# Altium project Zapper.PrjPcb (part 1 of 3)
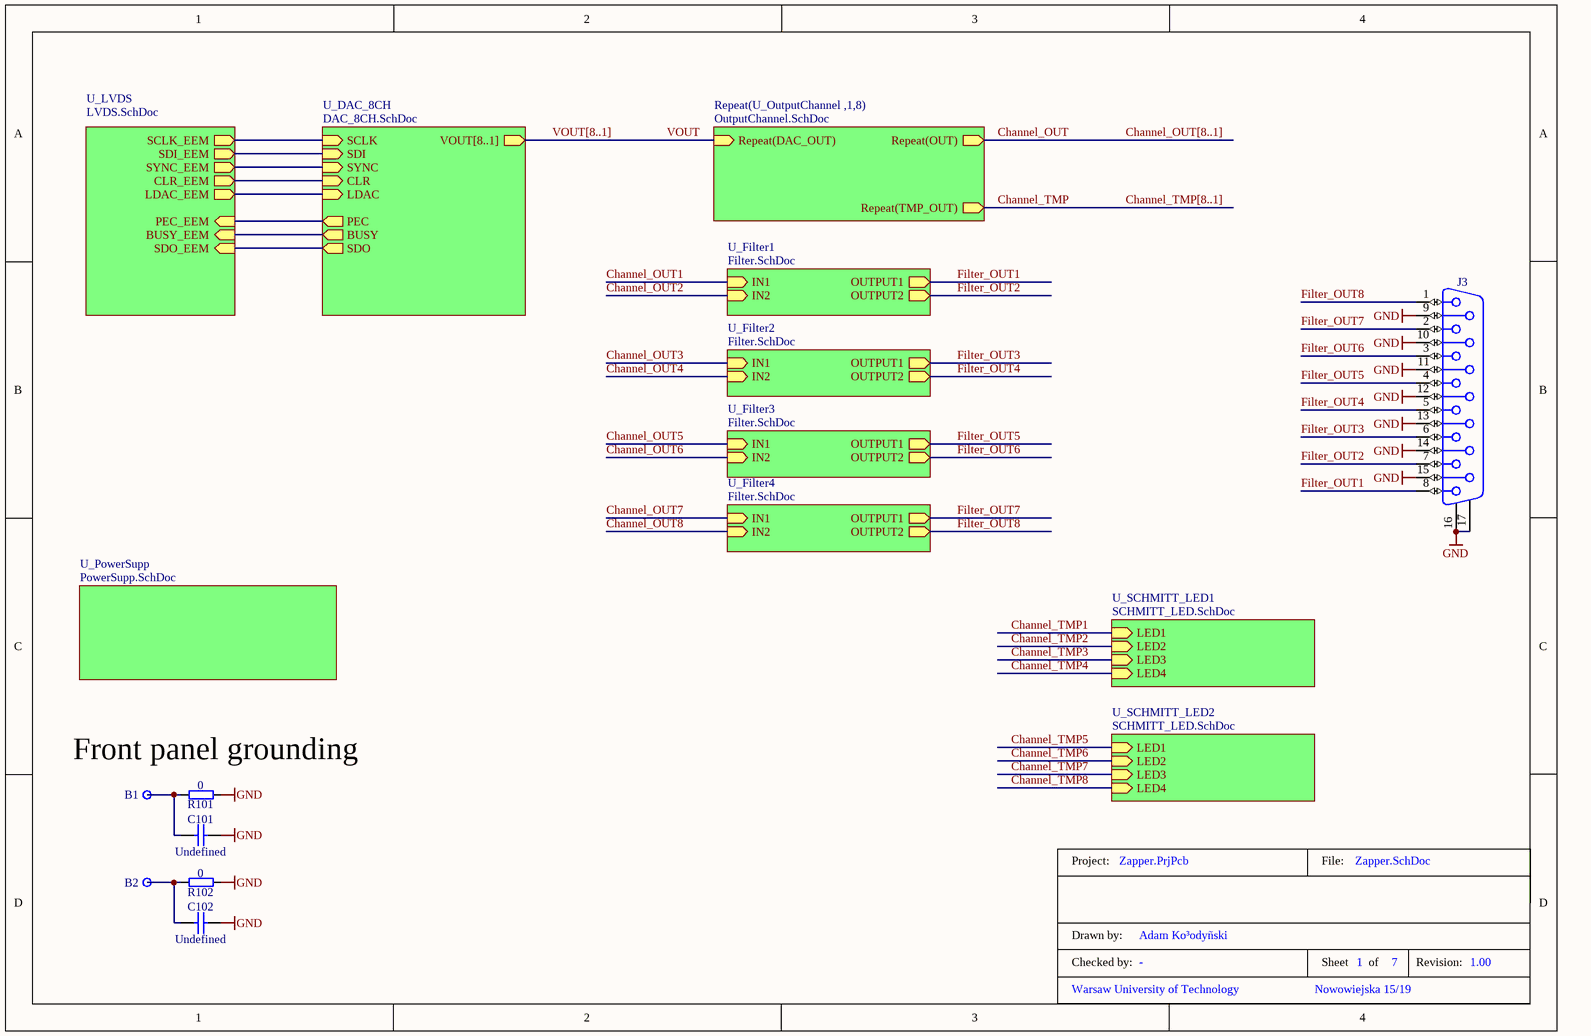
[diagram p0: Zapper.SchDoc]
AddressCompany: Nowowiejska 15/19; CheckedByName: -; Company: Warsaw University of Technology; DrawnByName: Adam Ko³odyñski; RevisionNumber: 1.00
7 sheets, 431 parts. Net scope: hierarchical (ports join the sheet entries above them; power ports are global).
Board file: Zapper.PcbDoc
Sheets:
  Zapper.SchDoc
    U_LVDS = LVDS.SchDoc
    U_DAC_8CH = DAC_8CH.SchDoc
    U_SCHMITT_LED1 = SCHMITT_LED.SchDoc
    U_SCHMITT_LED2 = SCHMITT_LED.SchDoc
    U_OutputChannel1 = OutputChannel.SchDoc
    U_OutputChannel2 = OutputChannel.SchDoc
    U_OutputChannel3 = OutputChannel.SchDoc
    U_OutputChannel4 = OutputChannel.SchDoc
    U_OutputChannel5 = OutputChannel.SchDoc
    U_OutputChannel6 = OutputChannel.SchDoc
    U_OutputChannel7 = OutputChannel.SchDoc
    U_OutputChannel8 = OutputChannel.SchDoc
    U_PowerSupp = PowerSupp.SchDoc
    U_Filter1 = Filter.SchDoc
    U_Filter2 = Filter.SchDoc
    U_Filter3 = Filter.SchDoc
    U_Filter4 = Filter.SchDoc

## Sheet Zapper.SchDoc
size A4; DocumentNumber: 1; SheetNumber: 1; SheetTotal: 7

### Parts
B1  Plated Hole  [MTG270_500]  (value not drawn)
B2  Plated Hole  [MTG270_500]  (value not drawn)
C101  Undefined  [CAPC2012X135N]
C102  Undefined  [CAPC2012X135N]
J3  D-Sub 15F  [HARTING_09 66 252 6612]  (value not drawn)
R101  0  [RESC1608X55N]
R102  0  [RESC1608X55N]
TitleBlock1  TitleBlock  (value not drawn)  (graphical)

### Sub-sheets
Repeat(U_OutputChannel ,1,8) = OutputChannel.SchDoc: Repeat(OUT) (out), Repeat(DAC_OUT) (in), Repeat(TMP_OUT) (out)
U_DAC_8CH = DAC_8CH.SchDoc: SCLK (in), SDI (in), SYNC (in), BUSY (out), CLR (in), LDAC (in), PEC (out), SDO (out), VOUT[8..1] (out)
U_Filter1 = Filter.SchDoc: IN1 (in), IN2 (in), OUTPUT1 (out), OUTPUT2 (out)
U_Filter2 = Filter.SchDoc: IN1 (in), IN2 (in), OUTPUT1 (out), OUTPUT2 (out)
U_Filter3 = Filter.SchDoc: IN1 (in), IN2 (in), OUTPUT1 (out), OUTPUT2 (out)
U_Filter4 = Filter.SchDoc: IN1 (in), IN2 (in), OUTPUT1 (out), OUTPUT2 (out)
U_LVDS = LVDS.SchDoc: SCLK_EEM (out), SDO_EEM (in), SDI_EEM (out), SYNC_EEM (out), CLR_EEM (out), BUSY_EEM (in), LDAC_EEM (out), PEC_EEM (in)
U_PowerSupp = PowerSupp.SchDoc: no entries
U_SCHMITT_LED1 = SCHMITT_LED.SchDoc: LED1 (in), LED2 (in), LED3 (in), LED4 (in)
U_SCHMITT_LED2 = SCHMITT_LED.SchDoc: LED1 (in), LED2 (in), LED3 (in), LED4 (in)

### Nets
GND: C101.2 C102.2 J3.9 J3.10 J3.11 J3.12 J3.13 J3.14 J3.15 J3.16 J3.17 R101.1 R102.1
BUSY: sheet U_LVDS/BUSY_EEM, sheet U_DAC_8CH/BUSY
Channel_OUT: sheet Repeat(U_OutputChannel ,1,8)/Repeat(OUT)
Channel_TMP: sheet Repeat(U_OutputChannel ,1,8)/Repeat(TMP_OUT)
CLR: sheet U_LVDS/CLR_EEM, sheet U_DAC_8CH/CLR
Filter_OUT1: J3.8 ; sheet U_Filter1/OUTPUT1
Filter_OUT2: J3.7 ; sheet U_Filter1/OUTPUT2
Filter_OUT3: J3.6 ; sheet U_Filter2/OUTPUT1
Filter_OUT4: J3.5 ; sheet U_Filter2/OUTPUT2
Filter_OUT5: J3.4 ; sheet U_Filter3/OUTPUT1
Filter_OUT6: J3.3 ; sheet U_Filter3/OUTPUT2
Filter_OUT7: J3.2 ; sheet U_Filter4/OUTPUT1
Filter_OUT8: J3.1 ; sheet U_Filter4/OUTPUT2
LDAC: sheet U_LVDS/LDAC_EEM, sheet U_DAC_8CH/LDAC
PEC: sheet U_LVDS/PEC_EEM, sheet U_DAC_8CH/PEC
SCLK: sheet U_LVDS/SCLK_EEM, sheet U_DAC_8CH/SCLK
SDI: sheet U_LVDS/SDI_EEM, sheet U_DAC_8CH/SDI
SDO: sheet U_LVDS/SDO_EEM, sheet U_DAC_8CH/SDO
SYNC: sheet U_LVDS/SYNC_EEM, sheet U_DAC_8CH/SYNC
VOUT: sheet Repeat(U_OutputChannel ,1,8)/Repeat(DAC_OUT)
NetB1_1: B1.1 C101.1 R101.2
NetB2_1: B2.1 C102.1 R102.2

### Buses and harness runs
bus Channel_OUT[8..1]
bus Channel_TMP[8..1]
bus VOUT[8..1] = sheet U_DAC_8CH/VOUT[8..1]

### Notes on the sheet
- Front panel grounding
- (in symbol TitleBlock) Project:; File:; Drawn by:; Checked by:; Sheet; of; Revision:

### Library data of the parts
B1 B2 = PLATED_HOLE2.7_PAD5.0: Single Terminal Socket; Part Description: Plated Through Hole: Hole Dia.=2.7mm Pad Dia.=5.0mm; Mounted: No; Part Number: PLATED_HOLE2.7_PAD5.0; Component Kind: Standard (No BOM); Component Type: Standard (No BOM); Pin Count: 1; Family: Plated Hole; Socket: No; SMD: No; Sense: No; Status: None; ComponentHeight: 0mm; HelpURL: Undefined; Author: CERN DEM JMW; CreateDate: 27.09.2011; LatestRevisionDate: 27.09.2011; PackageDescription: Plated Through Hole: Hole Dia.=2.7mm Pad Dia.=5.0mm
C101 C102 = CC0805_NO-VALUE: Non-polarised capacitor; Part Description: Reserved Footprint For 0805(2012) Chip Ceramic Capacitor; Mounted: No; Part Number: CC0805_NO-VALUE; Component Kind: Standard; Component Type: Standard; Pin Count: 2; Value: Undefined; Status: None; Manufacturer: Undefined; Manufacturer Part Number: CC0805_NO-VALUE; Case: 0805; Socket: No; SMD: Yes; Sense: No; Manufacturer1 ComponentHeight: 1.35mm; HelpURL: Undefined; Author: CERN DEM JLC; CreateDate: 10.12.2008; LatestRevisionDate: 11.09.2013
J3 = HARTING_09 66 252 6612: Connector D-sub 15 Female; Part Description: Right Angled D-Sub 15 Female Contacts With Grounding Board Locks And UNC 4-40 Flange Thread; PressFit: No; Part Number: HARTING_09 66 252 6612; Component Kind: Standard; Component Type: Standard; Pin Count: 17; Family: D-Sub 15F; Mounted: Yes; Socket: No; SMD: No; Sense: No; Status: None; Manufacturer: HARTING; Manufacturer Part Number: 09 66 252 6612; ComponentHeight: 13.6mm; HelpURL: \\cern.ch\dfs\Applications\Altium\Datasheets\HARTING_09 66 252 6612.pdf; Author: CERN DEM JLC; CreateDate: 17.07.2013; LatestRevisionDate: 17.07.2013
R101 R102 = R0603_0R_JUMPER: Resistor; Part Description: 1A (0.05R Max DC Resistance) Zero Ohm Jumper; Manufacturer: GENERIC; Manufacturer1 Part Number: NRC06Z0; PressFit: No; Part Number: R0603_0R_JUMPER; Component Kind: Standard; Component Type: Standard; Pin Count: 2; Value: 0; Status: Preferred; Manufacturer Part Number: R0603_0R_JUMPER; Case: 0603; Mounted: Yes; Sense: No; Socket: No; SMD: Yes; Manufacturer1 Example: NIC COMPONENT; Manufacturer1 ComponentHeight: 0.55mm; HelpURL: \\cern.ch\dfs\Applications\Altium\Datasheets\R0603_NIC_NRC.pdf; Author: CERN DEM JLC; CreateDate: 03.12.2007; LatestRevisionDate: 13.03.2008

## Sheet LVDS.SchDoc
size A4; DocumentNumber: 2; SheetNumber: 2; SheetTotal: 7
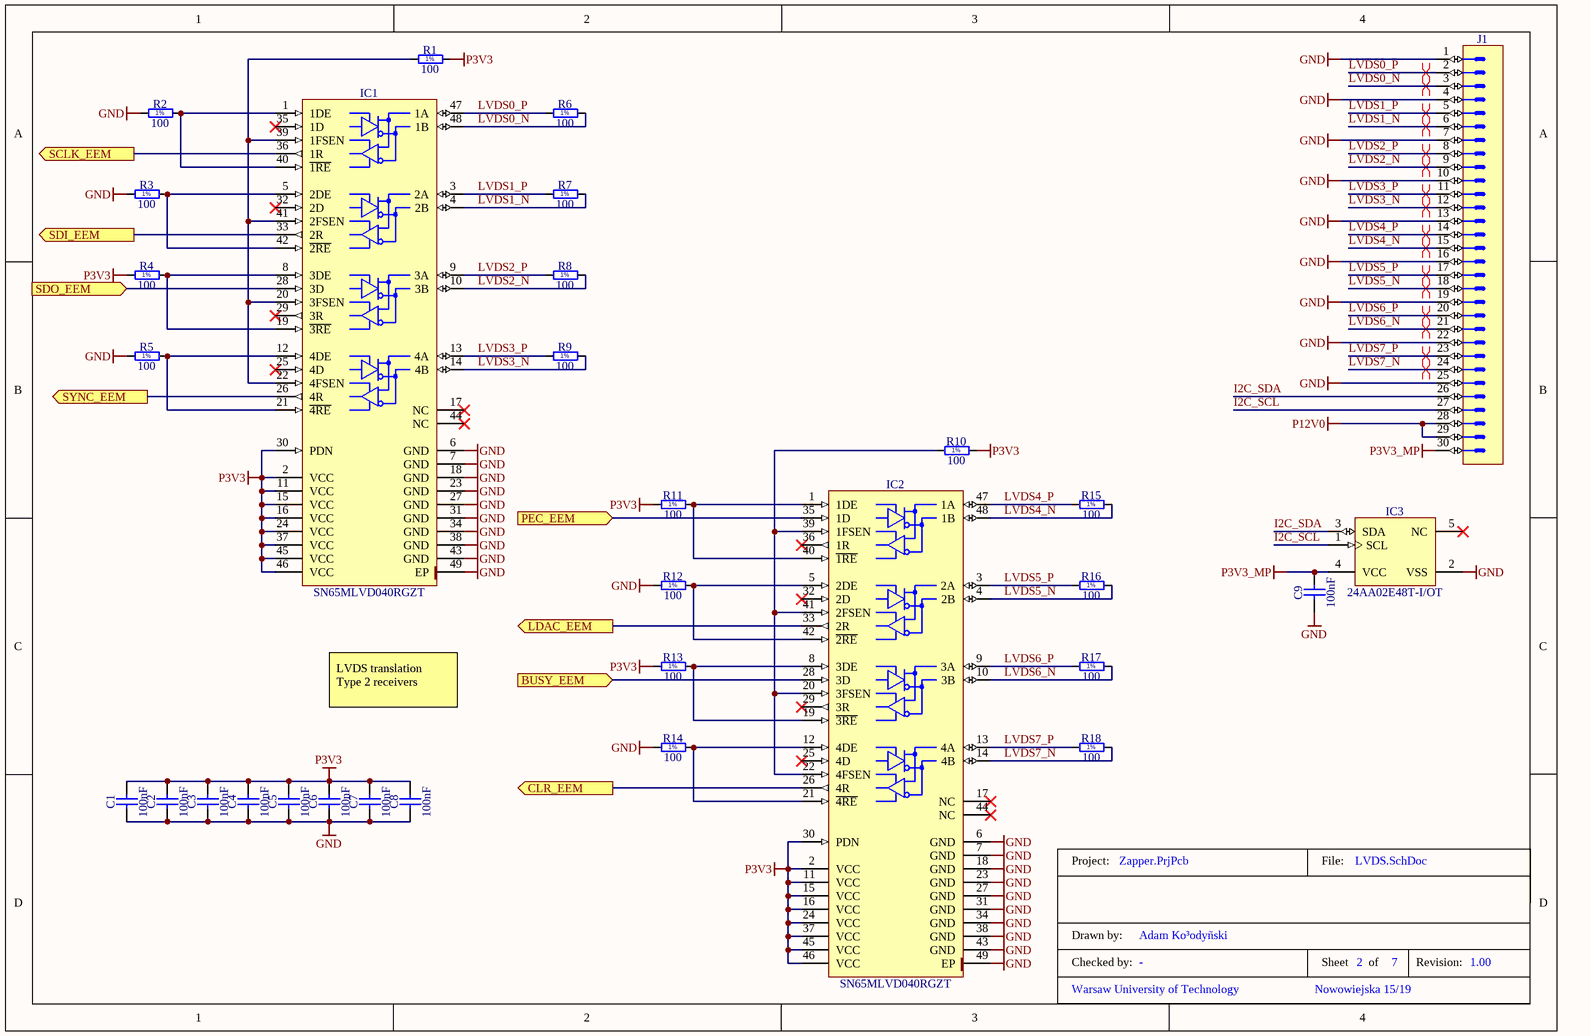
[diagram p1: LVDS.SchDoc]

### Parts
C1  100nF  [CAPC1005X55N]
C2  100nF  [CAPC1005X55N]
C3  100nF  [CAPC1005X55N]
C4  100nF  [CAPC1005X55N]
C5  100nF  [CAPC1005X55N]
C6  100nF  [CAPC1005X55N]
C7  100nF  [CAPC1005X55N]
C8  100nF  [CAPC1005X55N]
C9  100nF  [CAPC1005X55N]
IC1  SN65MLVD040RGZT  [QFN50P700X700X100-49N-S420]
IC2  SN65MLVD040RGZT  [QFN50P700X700X100-49N-S420]
IC3  24AA02E48T-I/OT  [SOT95P280X145-5N]
J1  Header 30  [3M_N2530-6002RB]  (value not drawn)
R1  100  [RESC1005X40N]
R2  100  [RESC1005X40N]
R3  100  [RESC1005X40N]
R4  100  [RESC1005X40N]
R5  100  [RESC1005X40N]
R6  100  [RESC1005X40N]
R7  100  [RESC1005X40N]
R8  100  [RESC1005X40N]
R9  100  [RESC1005X40N]
R10  100  [RESC1005X40N]
R11  100  [RESC1005X40N]
R12  100  [RESC1005X40N]
R13  100  [RESC1005X40N]
R14  100  [RESC1005X40N]
R15  100  [RESC1005X40N]
R16  100  [RESC1005X40N]
R17  100  [RESC1005X40N]
R18  100  [RESC1005X40N]
TitleBlock2  TitleBlock  (value not drawn)  (graphical)

### Ports
BUSY_EEM (in), CLR_EEM (out), LDAC_EEM (out), PEC_EEM (in), SCLK_EEM (out), SDI_EEM (out), SDO_EEM (in), SYNC_EEM (out)

### Nets
GND: C1.1 C2.1 C3.1 C4.1 C5.1 C6.1 C7.1 C8.1 C9.1 IC1.6(GND) IC1.7(GND) IC1.18(GND) IC1.23(GND) IC1.27(GND) IC1.31(GND) IC1.34(GND) IC1.38(GND) IC1.43(GND) IC1.49(EP) IC2.6(GND) IC2.7(GND) IC2.18(GND) IC2.23(GND) IC2.27(GND) IC2.31(GND) IC2.34(GND) IC2.38(GND) IC2.43(GND) IC2.49(EP) IC3.2(VSS) J1.1 J1.4 J1.7 J1.10 J1.13 J1.16 J1.19 J1.22 J1.25 R2.1 R3.1 R5.1 R12.1 R14.1
P3V3: C1.2 C2.2 C3.2 C4.2 C5.2 C6.2 C7.2 C8.2 IC1.2(VCC) IC1.11(VCC) IC1.15(VCC) IC1.16(VCC) IC1.24(VCC) IC1.30(PDN) IC1.37(VCC) IC1.45(VCC) IC1.46(VCC) IC2.2(VCC) IC2.11(VCC) IC2.15(VCC) IC2.16(VCC) IC2.24(VCC) IC2.30(PDN) IC2.37(VCC) IC2.45(VCC) IC2.46(VCC) R1.2 R4.1 R10.2 R11.1 R13.1
P3V3_MP: C9.2 IC3.4(VCC) J1.30
P12V0: J1.28 J1.29
BUSY: IC2.28(3D) ; port BUSY_EEM
CLR: IC2.26(4R) ; port CLR_EEM
I2C_SCL: IC3.1(SCL) J1.27
I2C_SDA: IC3.3(SDA) J1.26
LDAC: IC2.33(2R) ; port LDAC_EEM
LVDS0_N: IC1.48(1B) J1.3 R6.2
LVDS0_P: IC1.47(1A) J1.2 R6.1
LVDS1_N: IC1.4(2B) J1.6 R7.2
LVDS1_P: IC1.3(2A) J1.5 R7.1
LVDS2_N: IC1.10(3B) J1.9 R8.2
LVDS2_P: IC1.9(3A) J1.8 R8.1
LVDS3_N: IC1.14(4B) J1.12 R9.2
LVDS3_P: IC1.13(4A) J1.11 R9.1
LVDS4_N: IC2.48(1B) J1.15 R15.2
LVDS4_P: IC2.47(1A) J1.14 R15.1
LVDS5_N: IC2.4(2B) J1.18 R16.2
LVDS5_P: IC2.3(2A) J1.17 R16.1
LVDS6_N: IC2.10(3B) J1.21 R17.2
LVDS6_P: IC2.9(3A) J1.20 R17.1
LVDS7_N: IC2.14(4B) J1.24 R18.2
LVDS7_P: IC2.13(4A) J1.23 R18.1
PEC: IC2.35(1D) ; port PEC_EEM
SCLK: IC1.36(1R) ; port SCLK_EEM
SDI: IC1.33(2R) ; port SDI_EEM
SDO: IC1.28(3D) ; port SDO_EEM
SYNC: IC1.26(4R) ; port SYNC_EEM
NetIC1_1: IC1.1(1DE) IC1.40(~{1RE}) R2.2
NetIC1_5: IC1.5(2DE) IC1.42(~{2RE}) R3.2
NetIC1_8: IC1.8(3DE) IC1.19(~{3RE}) R4.2
NetIC1_12: IC1.12(4DE) IC1.21(~{4RE}) R5.2
NetIC1_20: IC1.20(3FSEN) IC1.22(4FSEN) IC1.39(1FSEN) IC1.41(2FSEN) R1.1
NetIC2_1: IC2.1(1DE) IC2.40(~{1RE}) R11.2
NetIC2_5: IC2.5(2DE) IC2.42(~{2RE}) R12.2
NetIC2_8: IC2.8(3DE) IC2.19(~{3RE}) R13.2
NetIC2_12: IC2.12(4DE) IC2.21(~{4RE}) R14.2
NetIC2_20: IC2.20(3FSEN) IC2.22(4FSEN) IC2.39(1FSEN) IC2.41(2FSEN) R10.1

Not connected (* = marked no-connect by the designer): IC1 17(NC)* 25(4D)* 29(3R)* 32(2D)* 35(1D)* 44(NC)*; IC2 17(NC)* 25(4D)* 29(3R)* 32(2D)* 36(1R)* 44(NC)*; IC3 5(NC)*

### Layout directives
differential pair: LVDS0_N, LVDS0_P, LVDS1_N, LVDS1_P, LVDS2_N, LVDS2_P, LVDS3_N, LVDS3_P, LVDS4_N, LVDS4_P, LVDS5_N, LVDS5_P, LVDS6_N, LVDS6_P, LVDS7_N, LVDS7_P

### Notes on the sheet
- LVDS translation    Type 2 receivers
- (in symbol R0402_100R_1%_0.1W_100PPM) 1%
- (in symbol TitleBlock) Project:; File:; Drawn by:; Checked by:; Sheet; of; Revision:

### Library data of the parts
C1-C9 = CC0402_100NF_16V_10%_X7R: Non-polarised capacitor; Part Description: SMD Multilayer Chip Ceramic Capacitor; Manufacturer: GENERIC; Manufacturer1 Part Number: GRM155R71C104KA88D; Voltage: 16V; TC: X7R; Tolerance: ±10%; Part Number: CC0402_100NF_16V_10%_X7R; Component Kind: Standard; Component Type: Standard; Pin Count: 2; Value: 100nF; Status: Not Recommended; Manufacturer Part Number: CC0402_100NF_16V_10%_X7R; Case: 0402; Mounted: Yes; Socket: No; SMD: Yes; Sense: No; Manufacturer1 Example: MURATA; Manufacturer1 ComponentHeight: 0.55mm; HelpURL: \\cern.ch\dfs\Applications\Altium\Datasheets\CC0402_X7R_MURATA_GRM.pdf; Author: CERN DEM JLC; CreateDate: 05.12.2013; LatestRevisionDate: 03.12.2007
IC1 IC2 = SN65MLVD040RGZT: 4-Channel Half-Duplex M-LVDS Line Transceiver; Manufacturer: TEXAS INSTRUMENTS; PressFit: No; Bonding: No; Part Number: SN65MLVD040RGZT; Component Kind: Standard; Component Type: Standard; Device: SN65MLVD040RGZT; PackageDescription: QFN, 0.50mm Pitch, Square; 48 Pin, 7.00mm L X 7.00mm W X 1.00mm H body (w/Thermal Tab 4.20 X 4.20mm), IPC Medium Density; Part Description: 4-Channel Half-Duplex M-LVDS Line Transceiver; Manufacturer Part Number: SN65MLVD040RGZT; Pin Count: 49; Case: QFN48; Mounted: Yes; Socket: No; SMD: Yes; Sense: No; ComponentHeight: 1mm; Author: CERN DEM JLC; HelpURL: \\cern.ch\dfs\Applications\Altium\Datasheets\SN65MLVD040RGZT.pdf; CreateDate: 17.03.2011; LatestRevisionDate: 17.03.2011
IC3 = 24AA02E48T-I/OT: 1.7V-5.5V, 2K I2C Serial EEPROM With EUI-48 Node Identity; Manufacturer: MICROCHIP TECHNOLOGY; PressFit: No; Bonding: No; Part Number: 24AA02E48T-I/OT; Component Kind: Standard; Component Type: Standard; Device: 24AA02E48T-I/OT; PackageDescription: SOT, 0.95mm pitch; 5 pin, 1.60mm W X 2.90mm L X 1.45mm H body, IPC Medium Density; Part Description: 1.7V-5.5V, 2K I2C Serial EEPROM With EUI-48 Node Identity; Manufacturer Part Number: 24AA02E48T-I/OT; Pin Count: 5; Case: SOT23-5; Mounted: Yes; Socket: No; SMD: Yes; Sense: No; ComponentHeight: 1.45mm; HelpURL: \\cern.ch\dfs\Applications\Altium\Datasheets\24AA02E48T-I-OT.pdf; Author: CERN DEM MR; CreateDate: 31.03.2016; LatestRevisionDate: 31.03.2016
J1 = 3M_N2530-6002RB: Connector 30 Male; Part Description: 30 Contacts - Straight .100'' x .100'' Low Profile Four-Wall Header, 2500 Series; Manufacturer: 3M; PressFit: No; Part Number: 3M_N2530-6002RB; Component Kind: Standard; Component Type: Standard; Pin Count: 30; Family: Header 30; Mounted: Yes; Socket: No; SMD: No; Sense: No; Status: None; Manufacturer Part Number: N2530-6002RB; ComponentHeight: 10.03mm; HelpURL: \\cern.ch\dfs\Applications\Altium\Datasheets\3M_N2530-6002RB.pdf; Author: CERN DEM JLC; CreateDate: 11.02.2009; LatestRevisionDate: 11.08.2009
R1-R18 = R0402_100R_1%_0.1W_100PPM: Resistor - 1%; Part Description: General Purpose Thick Film Chip Resistor; Manufacturer: GENERIC; Manufacturer Part Number: R0402_100R_1%_0.1W_100PPM_50V; Manufacturer1 Part Number: ERJ2RKF1000X; Power: 0.1W; TC: ±100ppm/°C; Voltage: 50V; PressFit: No; Part Number: R0402_100R_1%_0.1W_100PPM; Component Kind: Standard; Component Type: Standard; Pin Count: 2; Value: 100; Status: Not Recommended; Tolerance: ±1%; Case: 0402; Mounted: Yes; Sense: No; Socket: No; SMD: Yes; Manufacturer1 Example: PANASONIC; Manufacturer1 ComponentHeight: 0.4mm; HelpURL: \\cern.ch\dfs\Applications\Altium\Datasheets\R0402_PANASONIC_ERJ2RK.pdf; Author: CERN DEM JLC; CreateDate: 12.12.2013; LatestRevisionDate: 03.03.2015

## Sheet DAC_8CH.SchDoc
size A4; DocumentNumber: 3; SheetNumber: 3; SheetTotal: 7
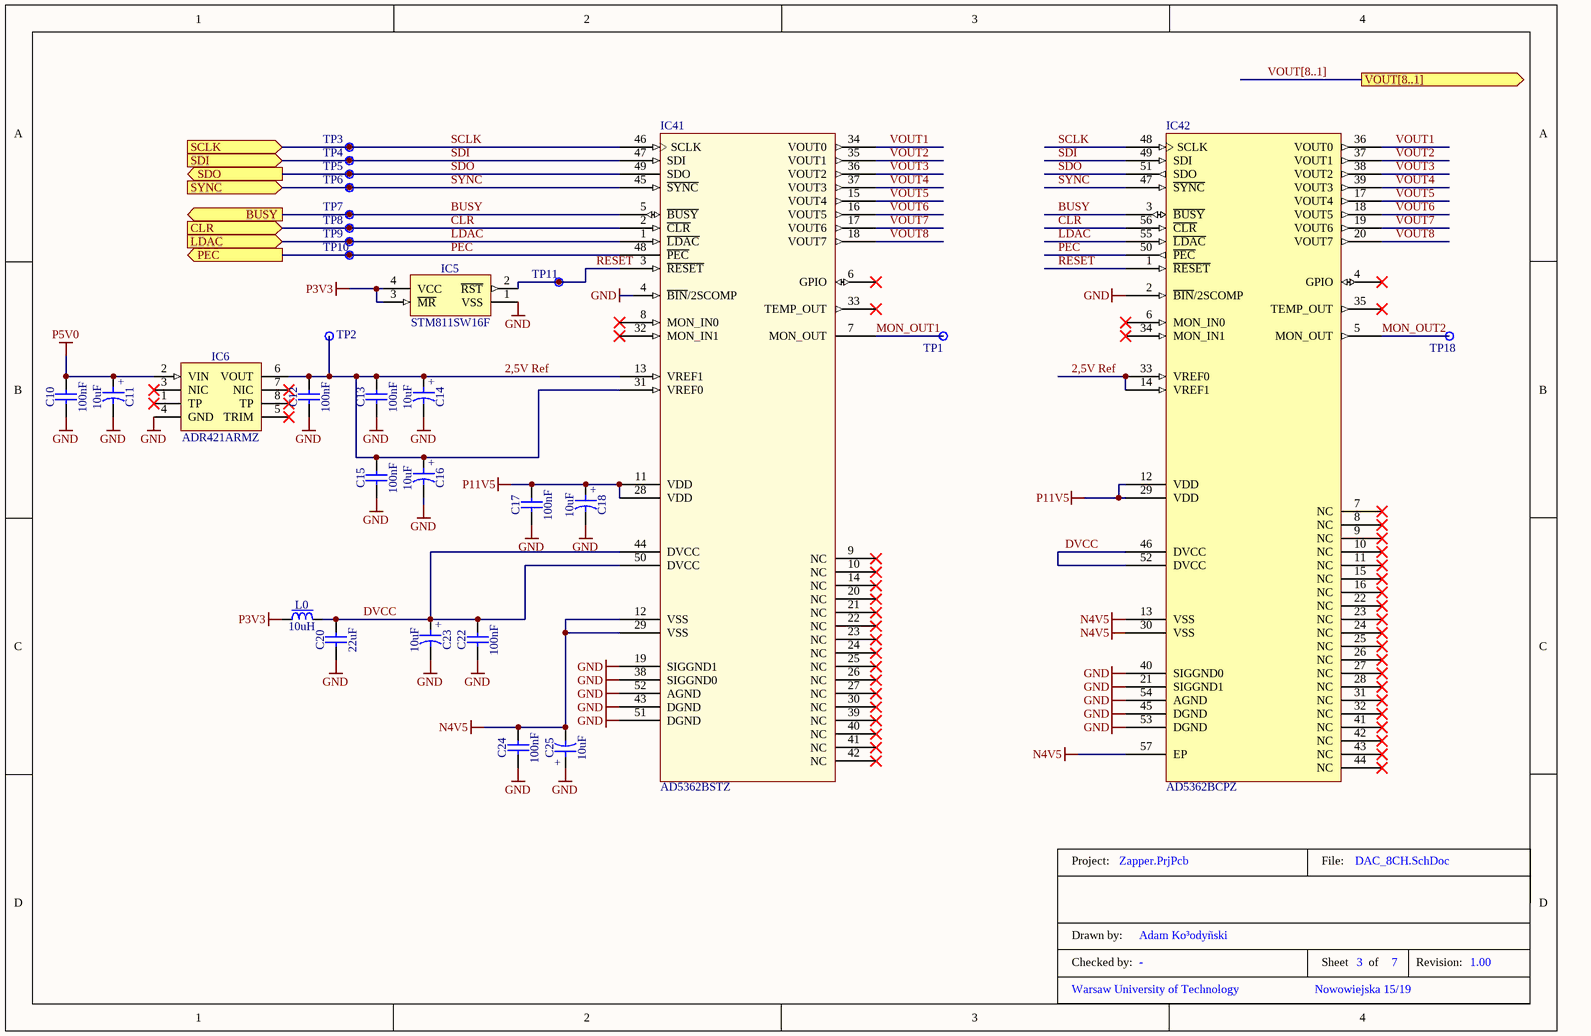
[diagram p2: DAC_8CH.SchDoc]

### Parts
C10  100nF  [CAPC1005X55N]
C11  10uF  [CAPMP3528X210N]
C12  100nF  [CAPC1005X55N]
C13  100nF  [CAPC1005X55N]
C14  10uF  [CAPMP3528X210N]
C15  100nF  [CAPC1005X55N]
C16  10uF  [CAPMP3528X210N]
C17  100nF  [CAPC1005X55N]
C18  10uF  [CAPMP3528X210N]
C20  22uF  [CAPC2012X135N]
C22  100nF  [CAPC1005X55N]
C23  10uF  [CAPMP3528X210N]
C24  100nF  [CAPC1005X55N]
C25  10uF  [CAPMP3528X210N]
IC5  STM811SW16F  [SOT143N]
IC6  ADR421ARMZ  [SOP65P490X110-8N]
IC41  AD5362BSTZ  [ST-52_N]
IC42  AD5362BCPZ  [CP-56-1_N]
L0  10uH  [IND_MURATA-PS_8400]
TitleBlock3  TitleBlock  (value not drawn)  (graphical)
TP1  Test Point  [TPS127]  (value not drawn)
TP2  Test Point  [TPS127]  (value not drawn)
TP3  Test Point  [TPS127]  (value not drawn)
TP4  Test Point  [TPS127]  (value not drawn)
TP5  Test Point  [TPS127]  (value not drawn)
TP6  Test Point  [TPS127]  (value not drawn)
TP7  Test Point  [TPS127]  (value not drawn)
TP8  Test Point  [TPS127]  (value not drawn)
TP9  Test Point  [TPS127]  (value not drawn)
TP10  Test Point  [TPS127]  (value not drawn)
TP11  Test Point  [TPS127]  (value not drawn)
TP18  Test Point  [TPS127]  (value not drawn)

### Ports
BUSY (out), CLR (in), LDAC (in), PEC (out), SCLK (in), SDI (in), SDO (out), SYNC (in), VOUT[8..1] (out)

### Nets
GND: C10.1 C11.2 C12.1 C13.1 C14.2 C15.1 C16.2 C17.1 C18.2 C20.1 C22.1 C23.2 C24.1 C25.1 IC5.1(VSS) IC6.4(GND) IC41.4(~{BIN}/2SCOMP) IC41.19(SIGGND1) IC41.38(SIGGND0) IC41.43(DGND) IC41.51(DGND) IC41.52(AGND) IC42.2(~{BIN}/2SCOMP) IC42.21(SIGGND1) IC42.40(SIGGND0) IC42.45(DGND) IC42.53(DGND) IC42.54(AGND)
N4V5: C24.2 C25.2 IC41.12(VSS) IC41.29(VSS) IC42.13(VSS) IC42.30(VSS) IC42.57(EP)
P3V3: IC5.3(~{MR}) IC5.4(VCC) L0.1
P5V0: C10.2 C11.1 IC6.2(VIN)
P11V5: C17.2 C18.1 IC41.11(VDD) IC41.28(VDD) IC42.12(VDD) IC42.29(VDD)
2,5V Ref: C12.2 C13.2 C14.1 C15.2 C16.1 IC6.6(VOUT) IC41.13(VREF1) IC41.31(VREF0) IC42.14(VREF1) IC42.33(VREF0) TP2.1
BUSY: IC41.5(~{BUSY}) IC42.3(~{BUSY}) TP7.1 ; port BUSY
CLR: IC41.2(~{CLR}) IC42.56(~{CLR}) TP8.1 ; port CLR
DVCC: C20.2 C22.2 C23.1 IC41.44(DVCC) IC41.50(DVCC) IC42.46(DVCC) IC42.52(DVCC) L0.2
LDAC: IC41.1(~{LDAC}) IC42.55(~{LDAC}) TP9.1 ; port LDAC
MON_OUT1: IC41.7(MON_OUT) TP1.1
MON_OUT2: IC42.5(MON_OUT) TP18.1
PEC: IC41.48(~{PEC}) IC42.50(~{PEC}) TP10.1 ; port PEC
~{RESET}: IC5.2(~{RST}) IC41.3(~{RESET}) IC42.1(~{RESET}) TP11.1
SCLK: IC41.46(SCLK) IC42.48(SCLK) TP3.1 ; port SCLK
SDI: IC41.47(SDI) IC42.49(SDI) TP4.1 ; port SDI
SDO: IC41.49(SDO) IC42.51(SDO) TP5.1 ; port SDO
SYNC: IC41.45(~{SYNC}) IC42.47(~{SYNC}) TP6.1 ; port SYNC
VOUT1: IC41.34(VOUT0) IC42.36(VOUT0)
VOUT2: IC41.35(VOUT1) IC42.37(VOUT1)
VOUT3: IC41.36(VOUT2) IC42.38(VOUT2)
VOUT4: IC41.37(VOUT3) IC42.39(VOUT3)
VOUT5: IC41.15(VOUT4) IC42.17(VOUT4)
VOUT6: IC41.16(VOUT5) IC42.18(VOUT5)
VOUT7: IC41.17(VOUT6) IC42.19(VOUT6)
VOUT8: IC41.18(VOUT7) IC42.20(VOUT7)

Not connected (* = marked no-connect by the designer): IC6 1(TP)* 3(NIC)* 5(TRIM)* 7(NIC)* 8(TP)*; IC41 6(GPIO)* 8(MON_IN0)* 9(NC)* 10(NC)* 14(NC)* 20(NC)* 21(NC)* 22(NC)* 23(NC)* 24(NC)* 25(NC)* 26(NC)* 27(NC)* 30(NC)* 32(MON_IN1)* 33(TEMP_OUT)* 39(NC)* 40(NC)* 41(NC)* 42(NC)*; IC42 4(GPIO)* 6(MON_IN0)* 7(NC)* 8(NC)* 9(NC)* 10(NC)* 11(NC)* 15(NC)* 16(NC)* 22(NC)* 23(NC)* 24(NC)* 25(NC)* 26(NC)* 27(NC)* 28(NC)* 31(NC)* 32(NC)* 34(MON_IN1)* 35(TEMP_OUT)* 41(NC)* 42(NC)* 43(NC)* 44(NC)*

### Buses and harness runs
bus VOUT[8..1] = port VOUT[8..1]

### Notes on the sheet
- (in symbol CTE3528-21_10UF_16V_20%_PANASONIC_TQC) +
- (in symbol TitleBlock) Project:; File:; Drawn by:; Checked by:; Sheet; of; Revision:

### Library data of the parts
C10 C12 C13 C15 C17 C22 C24 = CC0402_100NF_16V_10%_X7R: as C1 on sheet LVDS; Part Number: CC0402_100NF_16V_10%_X7R; Component Kind: Standard; Component Type: Standard; Pin Count: 2; Value: 100nF; Status: Not Recommended; Manufacturer Part Number: CC0402_100NF_16V_10%_X7R; Case: 0402; Mounted: Yes; Socket: No; SMD: Yes; Sense: No; Manufacturer1 Example: MURATA; Manufacturer1 ComponentHeight: 0.55mm; HelpURL: \\cern.ch\dfs\Applications\Altium\Datasheets\CC0402_X7R_MURATA_GRM.pdf; Author: CERN DEM JLC; CreateDate: 05.12.2013; LatestRevisionDate: 03.12.2007
C11 C14 C16 C18 C23 C25 = CTE3528-21_10UF_16V_20%_PANASONIC_TQC: Polarised capacitor; Part Description: ESR 0R1 Solid Tantalum Chip Capacitor; Manufacturer Part Number: 16TQC10M; Voltage: 16V; Tolerance: ±20%; Part Number: CTE3528-21_10UF_16V_20%_PANASONIC_TQC; Component Kind: Standard; Component Type: Standard; Pin Count: 2; Value: 10uF; Status: None; Manufacturer: PANASONIC; Case: B; Mounted: Yes; Socket: No; SMD: Yes; Sense: No; ComponentHeight: 2mm; HelpURL: \\cern.ch\dfs\Applications\Altium\Datasheets\CTE_PANASONIC_TQC.pdf; Author: CERN DEM JLC; CreateDate: 01.09.2014; LatestRevisionDate: 01.09.2014
C20 = CC0805_22UF_16V_10%_X5R: Non-polarised capacitor; Part Description: SMD Multilayer Chip Ceramic Capacitor; Manufacturer: GENERIC; Manufacturer1 Part Number: C2012X5R1C226KT; Voltage: 16V; TC: X5R; Tolerance: ±10%; Part Number: CC0805_22UF_16V_10%_X5R; Component Kind: Standard; Component Type: Standard; Pin Count: 2; Value: 22uF; Status: Preferred; Manufacturer Part Number: CC0805_22UF_16V_10%_X5R; Case: 0805; Mounted: Yes; Socket: No; SMD: Yes; Sense: No; Manufacturer1 Example: TDK; Manufacturer1 ComponentHeight: 1.35mm; HelpURL: \\cern.ch\dfs\Applications\Altium\Datasheets\CC0805_X5R_TDK_C.pdf; Author: CERN DEM JLC; CreateDate: 25.10.2012; LatestRevisionDate: 25.10.2012
IC5 = STM811SW16F: Microprocessor Reset Circuit; Part Description: 2.93V Reset Threshold Voltage Microprocessor Reset Circuit; Manufacturer: ST MICROELECTRONICS; PressFit: No; Bonding: No; Part Number: STM811SW16F; Component Kind: Standard; Component Type: Standard; Device: STM811SW16F; PackageDescription: SOT143, 4-Leads, Body 3.0x2.6mm (max), Pitch 1.92mm, IPC Medium Density; Manufacturer Part Number: STM811SW16F; Pin Count: 4; Case: SOT143; Mounted: Yes; Socket: No; SMD: Yes; Sense: No; ComponentHeight: 1.12mm; Author: CERN DEM JLC; HelpURL: \\cern.ch\dfs\Applications\Altium\Datasheets\STM811SW16F.pdf; CreateDate: 17.11.2016; LatestRevisionDate: 17.11.2016
IC6 = ADR421ARMZ: Ultraprecision, Low Noise, 2.048 V/2.500 V/  3.00 V/5.00 V XFET Voltage References; Part Description: 2.5V ±3mV 10ppm, Ultraprecision, Low Noise, XFET® Voltage References; Manufacturer: ANALOG DEVICES; PressFit: No; Bonding: No; Part Number: ADR421ARMZ; Component Kind: Standard; Component Type: Standard; Device: ADR421ARMZ; PackageDescription: SOP, 0.65mm pitch; 8 pin, 3.00mm W X 3.00mm L X 1.10mm H body, IPC Medium Density; Manufacturer Part Number: ADR421ARMZ; Pin Count: 8; Case: MSOP8; Mounted: Yes; Socket: No; SMD: Yes; Sense: No; ComponentHeight: 1.1mm; HelpURL: \\cern.ch\dfs\Applications\Altium\Datasheets\ADR421ARMZ.pdf; Author: CERN DEM JLC; CreateDate: 27.10.2011; LatestRevisionDate: 27.10.2011
IC41 = AD5362BSTZ: IC, 16BIT DAC, 8CH, SERIAL, 52LFCSP; Manufacturer 1: Analog Devices; Resolution: 16b; Settling Time: 20us; Integral Nonlinearity (INL): 4LSB; Output Type: Voltage; Interface: SPI,Serial; Number of Bits: 16; Sampling Rate: 540KS/s; Number of DAC Channels: 8; Max Supply Voltage: 16.5V; Min Supply Voltage: 8V; Max Power Dissipation: 209mW; Dual Supply Voltage: 15V; Differential Output: No; Polarity: Bipolar,Unipolar; Max Input Voltage: 5V; Min Input Voltage: 2V; Max Output Voltage: 20V; Slew Rate: 1V/µs; Nominal Supply Current: 8.5mA; Supplier 1: Arrow; Manufacturer Part Number 1: AD5362BSTZ; Stock 1: 15; Pricing 1: 1=43,05000, 5=41,82000, 10=40,47990, 25=37,43000, 50=36,88000, 100=33,58000, 250=32,20000 (USD); RoHS: Yes; Case/Package: LQFP; Number of Pins: 52; Contact Plating: Tin,Matte; Min Operating Temperature: -40°C; Max Operating Temperature: 85°C; Package Quantity: 1; Packaging: Tray; Max Dual Supply Voltage: 16.5V; Number of Converters: 8; Number of D/A Converters: 8; Power Dissipation: 209mW; Min Output Voltage: 8V; Number of Channels: 8; Number of Outputs: 8; Termination: SMD/SMT; Length: 10mm; Height: 1.4mm; Width: 10mm; Radiation Hardening: No; Lead Free: Contains Lead; REACH SVHC: No SVHC; ComponentLink1URL: https://datasheet.ciiva.com/1145/1789185-1145089.pdf?src-supplier=Avnet; ComponentLink1Description: https://datasheet.ciiva.com/1145/1789185-1145089.pdf?src-supplier=Avnet; ComponentLink2URL: https://datasheet.ciiva.com/1145/1789185-1145089.pdf?src-supplier=Farnell; ComponentLink2Description: https://datasheet.ciiva.com/1145/1789185-1145089.pdf?src-supplier=Farnell; ComponentLink3URL: https://datasheet.ciiva.com/26802/ad5362bstz-26802160.pdf?src-supplier=IIIC; ComponentLink3Description: https://datasheet.ciiva.com/26802/ad5362bstz-26802160.pdf?src-supplier=IIIC; ComponentLink4URL: https://datasheet.ciiva.com/1142/ad5362-5363-1142361.pdf?src-supplier=Element14; ComponentLink4Description: https://datasheet.ciiva.com/1142/ad5362-5363-1142361.pdf?src-supplier=Element14; ComponentLink5URL: https://datasheet.ciiva.com/1368/ad5362-5363-1368393.pdf?src-supplier=Digi-Key; ComponentLink5Description: https://datasheet.ciiva.com/1368/ad5362-5363-1368393.pdf?src-supplier=Digi-Key; ComponentLink6URL: https://datasheet.ciiva.com/8067/ad5362-5363-8067722.pdf?src-supplier=Element14; ComponentLink6Description: https://datasheet.ciiva.com/8067/ad5362-5363-8067722.pdf?src-supplier=Element14; ComponentLink7URL: https://datasheet.ciiva.com/15146/getdatasheetpartid-64274-15146331.pdf?src-supplier=Verical; ComponentLink7Description: https://datasheet.ciiva.com/15146/getdatasheetpartid-64274-15146331.pdf?src-supplier=Verical; ComponentLink8URL: https://datasheet.ciiva.com/16598/ad5362-5363-16598797.pdf?src-supplier=Avnet+Europe; ComponentLink8Description: https://datasheet.ciiva.com/16598/ad5362-5363-16598797.pdf?src-supplier=Avnet+Europe; Supplier Part Number 1: AD5362BSTZ
IC42 = AD5362BCPZ: DAC 8-CH Resistor-String 16-bit 56-Pin LFCSP EP Tray; Manufacturer 1: Analog Devices; Settling Time: 20us; Resolution: 16b; Interface: SPI,Serial; Number of Bits: 16; Output Type: Voltage; Integral Nonlinearity (INL): 4LSB; Number of Converters: 8; Sampling Rate: 540KS/s; Max Supply Voltage: 16.5V; Min Supply Voltage: 8V; Differential Output: No; Polarity: Bipolar,Unipolar; Max Power Dissipation: 209mW; Max Input Voltage: 5V; Min Input Voltage: 2V; Max Output Voltage: 20V; Dual Supply Voltage: 15V; Slew Rate: 1V/µs; Supplier 1: Digi-Key; Manufacturer Part Number 1: AD5362BCPZ; Stock 1: 39; Pricing 1: 1=45,65000, 10=42,58500, 25=40,80000, 100=35,70000 (USD); RoHS: Yes; Case/Package: LFCSP EP; Number of Pins: 56; Contact Plating: Tin,Matte; Min Operating Temperature: -40°C; Max Operating Temperature: 85°C; Package Quantity: 260; Packaging: Tray; Number of Channels: 8; Min Output Voltage: 8V; Number of DAC Channels: 8; Number of D/A Converters: 8; Power Dissipation: 209mW; Max Dual Supply Voltage: 16.5V; Conversion Rate: 540KS/s; Length: 8mm; Height: 1mm; Width: 8mm; Radiation Hardening: No; Lead Free: Contains Lead; REACH SVHC: No SVHC; ComponentLink1URL: https://datasheet.ciiva.com/26904/getdatasheetpartid-564152-26904872.pdf?src-supplier=Verical; ComponentLink1Description: https://datasheet.ciiva.com/26904/getdatasheetpartid-564152-26904872.pdf?src-supplier=Verical; ComponentLink2URL: https://datasheet.ciiva.com/25624/0900766b810b9edf-25624053.pdf?src-supplier=RSComponents; ComponentLink2Description: https://datasheet.ciiva.com/25624/0900766b810b9edf-25624053.pdf?src-supplier=RSComponents; ComponentLink3URL: https://datasheet.ciiva.com/26802/ad5362bcpz-26802158.pdf?src-supplier=IIIC; ComponentLink3Description: https://datasheet.ciiva.com/26802/ad5362bcpz-26802158.pdf?src-supplier=IIIC; ComponentLink4URL: https://datasheet.ciiva.com/1142/1789185-1142360.pdf?src-supplier=Element14; ComponentLink4Description: https://datasheet.ciiva.com/1142/1789185-1142360.pdf?src-supplier=Element14; ComponentLink5URL: https://datasheet.ciiva.com/3040/ad5362-5363-3040735.pdf?src-supplier=Avnet; ComponentLink5Description: https://datasheet.ciiva.com/3040/ad5362-5363-3040735.pdf?src-supplier=Avnet; ComponentLink6URL: https://datasheet.ciiva.com/16598/ad5362-5363-16598793.pdf?src-supplier=Avnet+Europe; ComponentLink6Description: https://datasheet.ciiva.com/16598/ad5362-5363-16598793.pdf?src-supplier=Avnet+Europe; ComponentLink7URL: https://datasheet.ciiva.com/1368/ad5362-5363-1368394.pdf?src-supplier=Digi-Key; ComponentLink7Description: https://datasheet.ciiva.com/1368/ad5362-5363-1368394.pdf?src-supplier=Digi-Key; Supplier Part Number 1: AD5362BCPZ-ND
L0 = IND_10UH_10%_MURATA-PS_8400: Inductor With Core; Part Description: Miniature Surface Mount Power Inductor (8400 Series); Manufacturer: MURATA POWER SOLUTIONS; Manufacturer Part Number: 84103C; Power: 950mA; Resistance: 0.24R; Tolerance: ±10%; Part Number: IND_10UH_10%_MURATA-PS_8400; Component Kind: Standard; Component Type: Standard; Pin Count: 2; Value: 10uH; Status: None; Mounted: Yes; Socket: No; SMD: Yes; Sense: No; ComponentHeight: 2.9mm; HelpURL: \\cern.ch\dfs\Applications\Altium\Datasheets\IND_MURATA-PS_8400.pdf; Author: CERN DEM JLC; CreateDate: 02.07.2012; LatestRevisionDate: 02.07.2012
TP1-TP11 TP18 = SMD_PAD_1.27X1.27MM: Part Description: 1.27mm x 1.27mm PCB Copper Area (SMD Test Point); Mounted: No; Part Number: SMD_PAD_1.27X1.27MM; Component Kind: Standard (No BOM); Component Type: Standard (No BOM); Pin Count: 1; Family: Test Point; Socket: No; SMD: Yes; Sense: No; Status: None; ComponentHeight: 0mm; HelpURL: Undefined; Author: CERN DEM JLC; CreateDate: 12.01.2008; LatestRevisionDate: 12.01.2008; PackageDescription: 1.27mm x 1.27mm PCB Copper Area (SMD Test Point)

## Sheet SCHMITT_LED.SchDoc
size A4; DocumentNumber: 6; SheetNumber: 6; SheetTotal: 7
Used 2 times, as channels U_SCHMITT_LED1, U_SCHMITT_LED2. Parts and nets are listed once, with the designators drawn on the sheet.
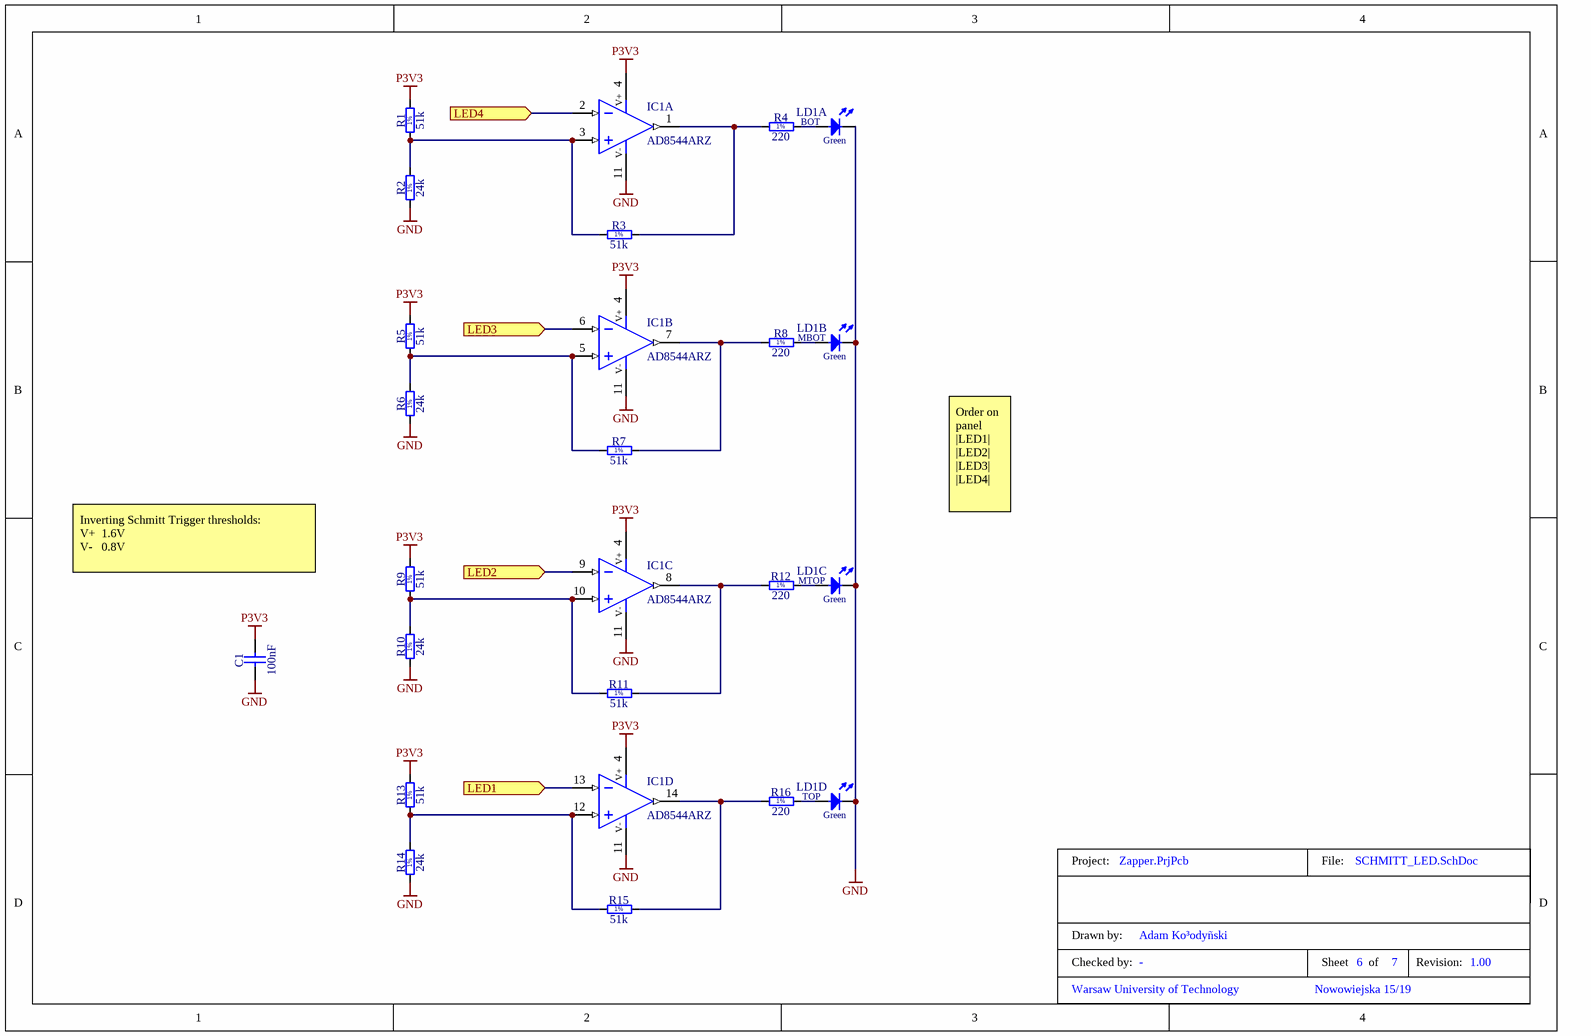
[diagram p3: SCHMITT_LED.SchDoc]

### Parts
C1  100nF  [CAPC1005X55N]
IC1  AD8544ARZ  [SOIC127P600X175-14N]  (parts A,B,C,D of 4)
LD1  Green  [LED_BIVAR_H485CGDL]  (value not drawn)  (parts A,B,C,D of 4)
R1  51k  [RESC1608X55N]
R2  24k  [RESC1608X55N]
R3  51k  [RESC1608X55N]
R4  220  [RESC1608X55N]
R5  51k  [RESC1608X55N]
R6  24k  [RESC1608X55N]
R7  51k  [RESC1608X55N]
R8  220  [RESC1608X55N]
R9  51k  [RESC1608X55N]
R10  24k  [RESC1608X55N]
R11  51k  [RESC1608X55N]
R12  220  [RESC1608X55N]
R13  51k  [RESC1608X55N]
R14  24k  [RESC1608X55N]
R15  51k  [RESC1608X55N]
R16  220  [RESC1608X55N]
TitleBlock6  TitleBlock  (value not drawn)  (graphical)

### Ports
LED1 (in), LED2 (in), LED3 (in), LED4 (in)

### Nets
GND: C1.1 IC1.11(V-) LD1.1(C) LD1.3(C) LD1.5(C) LD1.7(C) R2.1 R6.1 R10.1 R14.1
P3V3: C1.2 IC1.4(V+) R1.2 R5.2 R9.2 R13.2
LED1: IC1.13(IN-) ; port LED1
LED2: IC1.9(IN-) ; port LED2
LED3: IC1.6(IN-) ; port LED3
LED4: IC1.2(IN-) ; port LED4
NetIC1_1: IC1.1(OUT) R3.2 R4.1
NetIC1_3: IC1.3(IN+) R1.1 R2.2 R3.1
NetIC1_5: IC1.5(IN+) R5.1 R6.2 R7.1
NetIC1_7: IC1.7(OUT) R7.2 R8.1
NetIC1_8: IC1.8(OUT) R11.2 R12.1
NetIC1_10: IC1.10(IN+) R9.1 R10.2 R11.1
NetIC1_12: IC1.12(IN+) R13.1 R14.2 R15.1
NetIC1_14: IC1.14(OUT) R15.2 R16.1
NetLD1_2: LD1.2(A) R4.2
NetLD1_4: LD1.4(A) R8.2
NetLD1_6: LD1.6(A) R12.2
NetLD1_8: LD1.8(A) R16.2

### Channels
U_SCHMITT_LED1: designators end in _U_SCHMITT_LED1; ports LED1=Channel_TMP1 LED2=Channel_TMP2 LED3=Channel_TMP3 LED4=Channel_TMP4
U_SCHMITT_LED2: designators end in _U_SCHMITT_LED2; ports LED1=Channel_TMP5 LED2=Channel_TMP6 LED3=Channel_TMP7 LED4=Channel_TMP8

### Notes on the sheet
- Order on panel |LED1| |LED2| |LED3| |LED4|
- Inverting Schmitt Trigger thresholds:
  V+  1.6V
  V-   0.8V
- (in symbol LED_BIVAR_H485CGDL, part A) BOT
- (in symbol LED_BIVAR_H485CGDL, part B) MBOT
- (in symbol LED_BIVAR_H485CGDL, part C) MTOP
- (in symbol LED_BIVAR_H485CGDL, part D) TOP
- (in symbol R0603_24K_1%_0.1W_100PPM) 1%
- (in symbol R0603_51K_1%_0.1W_100PPM) 1%
- (in symbol R0603_220R_1%_0.1W_100PPM) 1%
- (in symbol TitleBlock) Project:; File:; Drawn by:; Checked by:; Sheet; of; Revision:

### Library data of the parts
C1 = CC0402_100NF_16V_10%_X7R: as C1 on sheet LVDS; Part Number: CC0402_100NF_16V_10%_X7R; Component Kind: Standard; Component Type: Standard; Pin Count: 2; Value: 100nF; Status: Not Recommended; Manufacturer Part Number: CC0402_100NF_16V_10%_X7R; Case: 0402; Mounted: Yes; Socket: No; SMD: Yes; Sense: No; Manufacturer1 Example: MURATA; Manufacturer1 ComponentHeight: 0.55mm; HelpURL: \\cern.ch\dfs\Applications\Altium\Datasheets\CC0402_X7R_MURATA_GRM.pdf; Author: CERN DEM JLC; CreateDate: 05.12.2013; LatestRevisionDate: 03.12.2007
IC1 = AD8544ARZ: Quad Operational Amplifier; Part Description: Quad CMOS Rail-to-Rail General-Purpose Amplifiers; Manufacturer: ANALOG DEVICES; PressFit: No; Bonding: No; Part Number: AD8544ARZ; Component Kind: Standard; Component Type: Standard; Device: AD8544ARZ; PackageDescription: SOIC 14, Pitch 1.27mm - Body 4x8.75mm, IPC Medium Density; Manufacturer Part Number: AD8544ARZ; Pin Count: 14; Case: SOIC14; Mounted: Yes; Socket: No; SMD: Yes; Sense: No; ComponentHeight: 1.75mm; Author: CERN DEM JLC; HelpURL: \\cern.ch\dfs\Applications\Altium\Datasheets\AD8544ARZ.pdf; CreateDate: 02.05.2012; LatestRevisionDate: 02.05.2012
LD1 = LED_BIVAR_H485CGDL: LED x4 Green 1C2A-BOT_3C4A_5C6A_7C8A-TOP; Part Description: Quad-Level 2mm Green LED, PCB Edge Mounting; Manufacturer: BIVAR; PressFit: No; Bonding: No; Part Number: LED_BIVAR_H485CGDL; Component Kind: Standard; Component Type: Standard; Color: Green; PackageDescription: Quad-Level 2mm Green, PCB Edge Mounting  BIVAR H485CHDL; Manufacturer Part Number: H485CGDL; Pin Count: 8; Mounted: Yes; Socket: No; SMD: No; Sense: No; ComponentHeight: 11.3mm; HelpURL: \\cern.ch\dfs\Applications\Altium\Datasheets\LED_BIVAR_H485CGDL.pdf; Author: CERN DEM JLC; CreateDate: 04.06.2012; LatestRevisionDate: 04.06.2012
R1 R3 R5 R7 R9 R11 R13 R15 = R0603_51K_1%_0.1W_100PPM: Resistor - 1%; Part Description: General Purpose Thick Film Chip Resistor; Manufacturer: GENERIC; Manufacturer1 Part Number: NRC06F5102TRF; Power: 0.1W; TC: ±100ppm/°C; PressFit: No; Part Number: R0603_51K_1%_0.1W_100PPM; Component Kind: Standard; Component Type: Standard; Pin Count: 2; Value: 51k; Status: Preferred; Tolerance: ±1%; Manufacturer Part Number: R0603_51K_1%_0.1W_100PPM; Case: 0603; Mounted: Yes; Sense: No; Socket: No; SMD: Yes; Manufacturer1 Example: NIC COMPONENT; Manufacturer1 ComponentHeight: 0.55mm; HelpURL: \\cern.ch\dfs\Applications\Altium\Datasheets\R0603_NIC_NRC.pdf; Author: CERN DEM JLC; CreateDate: 03.12.2007; LatestRevisionDate: 13.03.2008
R2 R6 R10 R14 = R0603_24K_1%_0.1W_100PPM: Resistor - 1%; Part Description: General Purpose Thick Film Chip Resistor; Manufacturer: GENERIC; Manufacturer1 Part Number: NRC06F2402TRF; Power: 0.1W; TC: ±100ppm/°C; PressFit: No; Part Number: R0603_24K_1%_0.1W_100PPM; Component Kind: Standard; Component Type: Standard; Pin Count: 2; Value: 24k; Status: Preferred; Tolerance: ±1%; Manufacturer Part Number: R0603_24K_1%_0.1W_100PPM; Case: 0603; Mounted: Yes; Sense: No; Socket: No; SMD: Yes; Manufacturer1 Example: NIC COMPONENT; Manufacturer1 ComponentHeight: 0.55mm; HelpURL: \\cern.ch\dfs\Applications\Altium\Datasheets\R0603_NIC_NRC.pdf; Author: CERN DEM JLC; CreateDate: 03.12.2007; LatestRevisionDate: 13.03.2008
R4 R8 R12 R16 = R0603_220R_1%_0.1W_100PPM: Resistor - 1%; Part Description: General Purpose Thick Film Chip Resistor; Manufacturer: GENERIC; Manufacturer1 Part Number: NRC06F2200TRF; Power: 0.1W; TC: ±100ppm/°C; PressFit: No; Part Number: R0603_220R_1%_0.1W_100PPM; Component Kind: Standard; Component Type: Standard; Pin Count: 2; Value: 220; Status: Preferred; Tolerance: ±1%; Manufacturer Part Number: R0603_220R_1%_0.1W_100PPM; Case: 0603; Mounted: Yes; Sense: No; Socket: No; SMD: Yes; Manufacturer1 Example: NIC COMPONENT; Manufacturer1 ComponentHeight: 0.55mm; HelpURL: \\cern.ch\dfs\Applications\Altium\Datasheets\R0603_NIC_NRC.pdf; Author: CERN DEM JLC; CreateDate: 03.12.2007; LatestRevisionDate: 13.03.2008